# Altium schematic sheet Output.SchDoc: Output
size A4; Address1: Smoka Wawelskiego 1; Address2: 30-535 Kraków, Poland; DocumentNumber: 3; Revision: v01; SheetNumber: 3; SheetTotal: 9; Author: Miroslaw Folejewski; CompanyName: Mirko Electronics; DrawnBy: Miroslaw Folejewski; Engineer: Miroslaw Folejewski; PageSetup: Record=PageOptions|CenterHorizontal=True|CenterVertical=True|PrintScale=1.00|XCorrection=1.00|YCorrection=1.00|PrintKind=0|BorderSize=5000000|LeftOffset=0|BottomOffset=0|Orientation=2|PaperLength=1000|PaperWidth=1000|Scale=100|PaperSource=7|PrintQuality=-4|MediaType=1|DitherType=10|PaperKind=A4|PrintScaleMode=1; PageSize: A4; Designators: -; ProjectName: 7-Segment LED Matrix Display
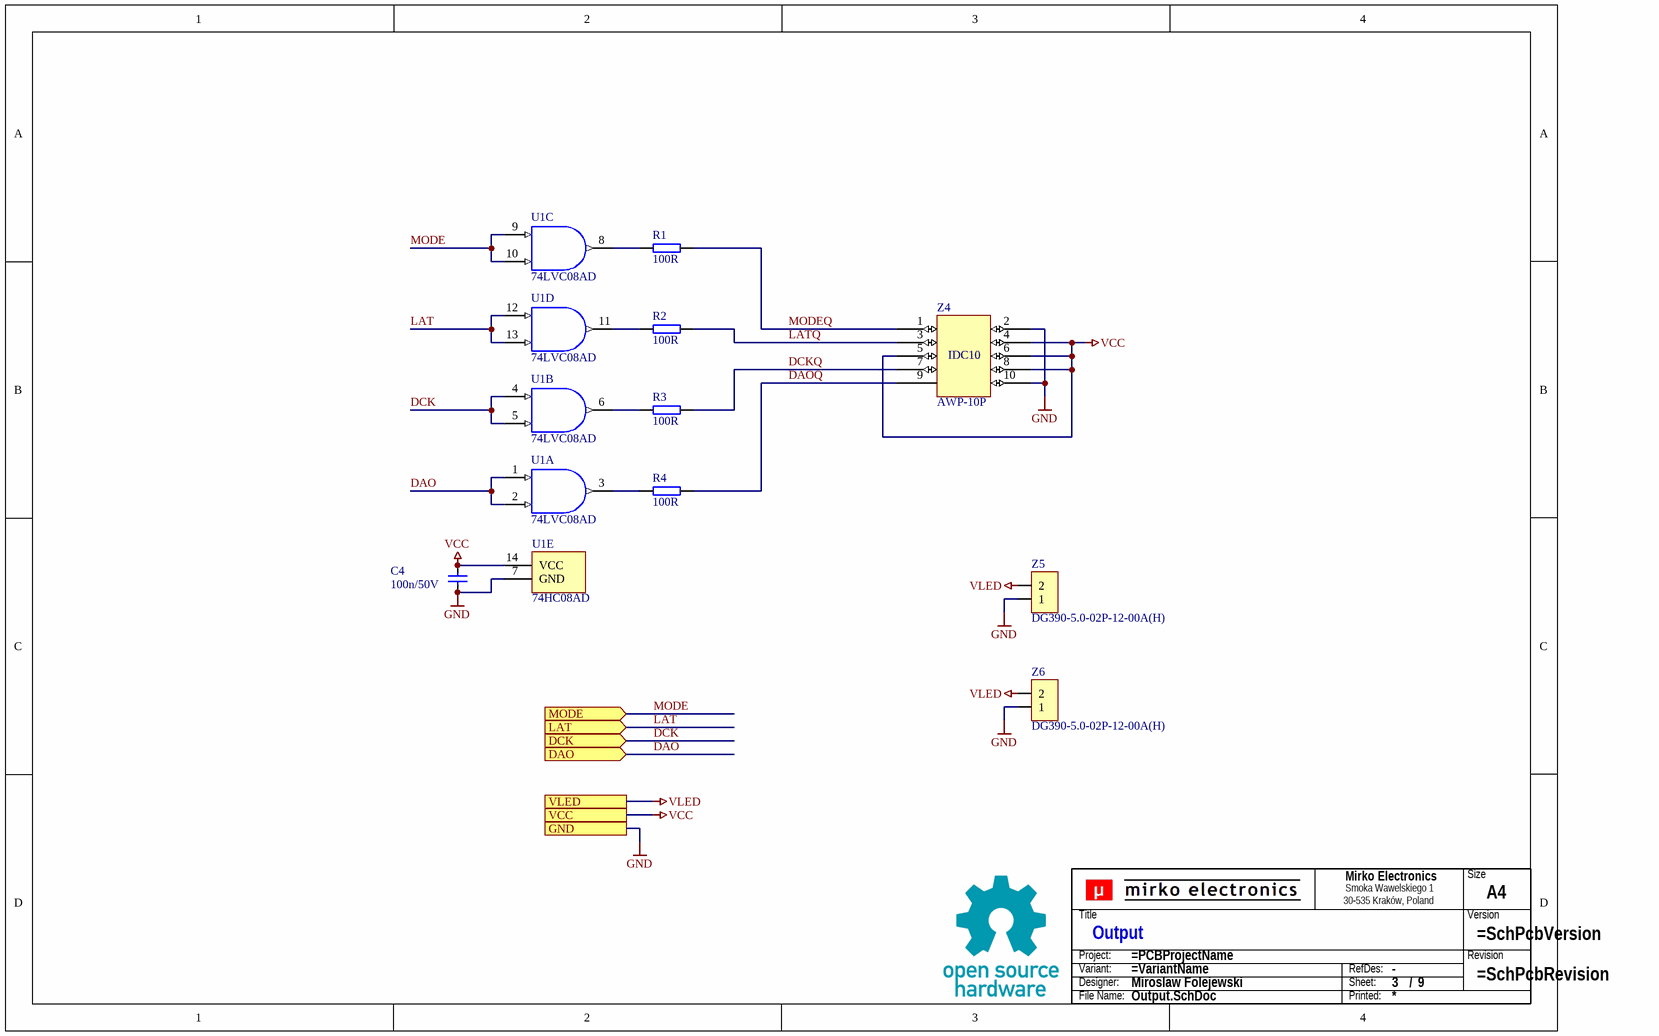
[diagram p0: Output.SchDoc]

## Parts
?  (no value)  (graphical)
C4  100n/50V  [0805]
R1  100R  [0805]
R2  100R  [0805]
R3  100R  [0805]
R4  100R  [0805]
TB?  Title block  (value not drawn)  (graphical)
U1  74LVC08AD  [SO14]  (parts A,B,C,D,E of 5)
Z4  AWP-10P  [BH10S]
Z5  DG390-5.0-02P-12-00A(H)  [WAGO2X2-5]
Z6  DG390-5.0-02P-12-00A(H)  [WAGO2X2-5]

## Ports
DAO (in), DCK (in), GND, LAT (in), MODE (in), VCC, VLED

## Nets
GND: C4.2 U1.7(GND) Z4.2 Z4.10 Z5.1 Z6.1 ; port GND
VCC: C4.1 U1.14(VCC) Z4.4 Z4.5 Z4.6 Z4.8 ; port VCC
VLED: Z5.2 Z6.2 ; port VLED
DAO: U1.1(A) U1.2(B) ; port DAO
DAOQ: R4.2 Z4.9
DCK: U1.4(A) U1.5(B) ; port DCK
DCKQ: R3.2 Z4.7
LAT: U1.12(A) U1.13(B) ; port LAT
LATQ: R2.2 Z4.3
MODE: U1.9(A) U1.10(B) ; port MODE
MODEQ: R1.2 Z4.1
NetR1_1: R1.1 U1.8(Y)
NetR2_1: R2.1 U1.11(Y)
NetR3_1: R3.1 U1.6(Y)
NetR4_1: R4.1 U1.3(Y)

## Notes on the sheet
- Title
- Size
- Revision
- Checked By:
- Project:
- Variant:
- Engineer:
- Date:
- Sheet:
- /
- Designators
- Approved By:
- File:
- (in symbol SCH_TITLE_BLOCK_V1) Size; Title; Version; Project:; Revision; Variant:; RefDes:; Designer:; Sheet:; /; File Name:; Printed:

## Library data of the parts
? = Title Block NeoStrain
C4 = CAP
R1-R4 = R0805
TB? = SCH_TITLE_BLOCK_V1: Component Type: Title block; Manufacturer: -; Mounting Type: Non component; MPN: -; Operating Temperature: -; Package: -; Specification: Title block; Value: Title block; Replacement: -; System: ?
U1 = 74AC08: Quadruple 2-Input Positive-AND Gate
Z4 = IDC10
Z5 Z6 = CON2: Connector